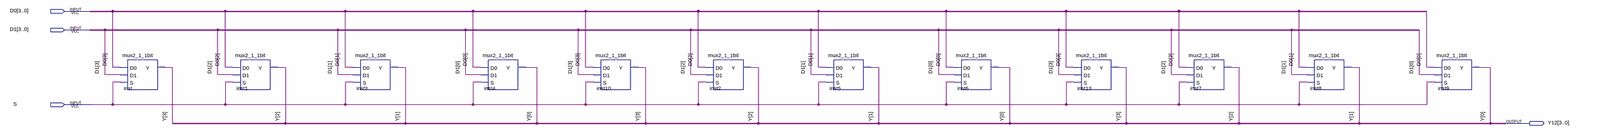
[diagram p0: schematic sheet, whole]
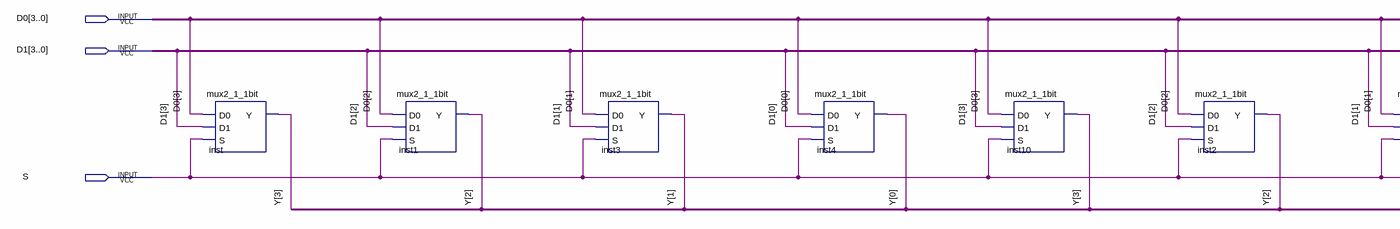
[diagram p1: schematic sheet, left part]
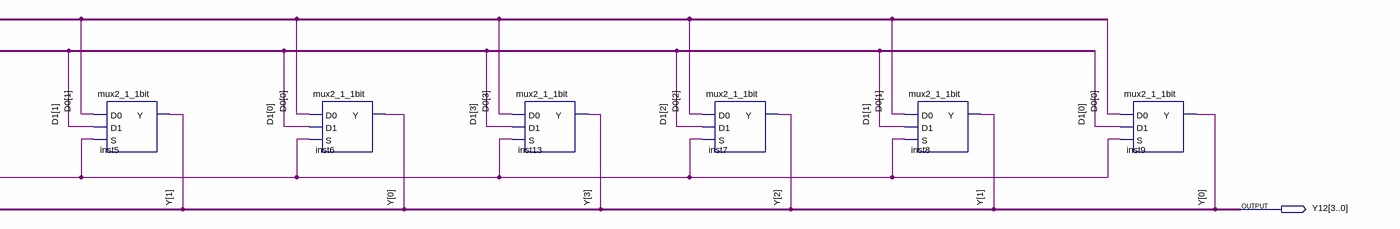
[diagram p2: schematic sheet, right part]
// Quartus schematic MUX2-1_4bit.bdf as structural Verilog: 12 symbols, 4 pins
module \MUX2-1_4bit  (
  input  [3:0] D0,
  input  [3:0] D1,
  input  S,
  output [3:0] Y12
);

  wire [3:0] Y;

  mux2_1_1bit inst (.D0(D0[3]), .D1(D1[3]), .S(S), .Y(Y[3]));
  mux2_1_1bit inst1 (.D0(D0[2]), .D1(D1[2]), .S(S), .Y(Y[2]));
  mux2_1_1bit inst3 (.D0(D0[1]), .D1(D1[1]), .S(S), .Y(Y[1]));
  mux2_1_1bit inst4 (.D0(D0[0]), .D1(D1[0]), .S(S), .Y(Y[0]));
  mux2_1_1bit inst10 (.D0(D0[3]), .D1(D1[3]), .S(S), .Y(Y[3]));
  mux2_1_1bit inst2 (.D0(D0[2]), .D1(D1[2]), .S(S), .Y(Y[2]));
  mux2_1_1bit inst5 (.D0(D0[1]), .D1(D1[1]), .S(S), .Y(Y[1]));
  mux2_1_1bit inst6 (.D0(D0[0]), .D1(D1[0]), .S(S), .Y(Y[0]));
  mux2_1_1bit inst13 (.D0(D0[3]), .D1(D1[3]), .S(S), .Y(Y[3]));
  mux2_1_1bit inst7 (.D0(D0[2]), .D1(D1[2]), .S(S), .Y(Y[2]));
  mux2_1_1bit inst8 (.D0(D0[1]), .D1(D1[1]), .S(S), .Y(Y[1]));
  mux2_1_1bit inst9 (.D0(D0[0]), .D1(D1[0]), .S(S), .Y(Y[0]));
endmodule
